# EAGLE design bicyclelab-manager-v3 (EAGLE 6.2)
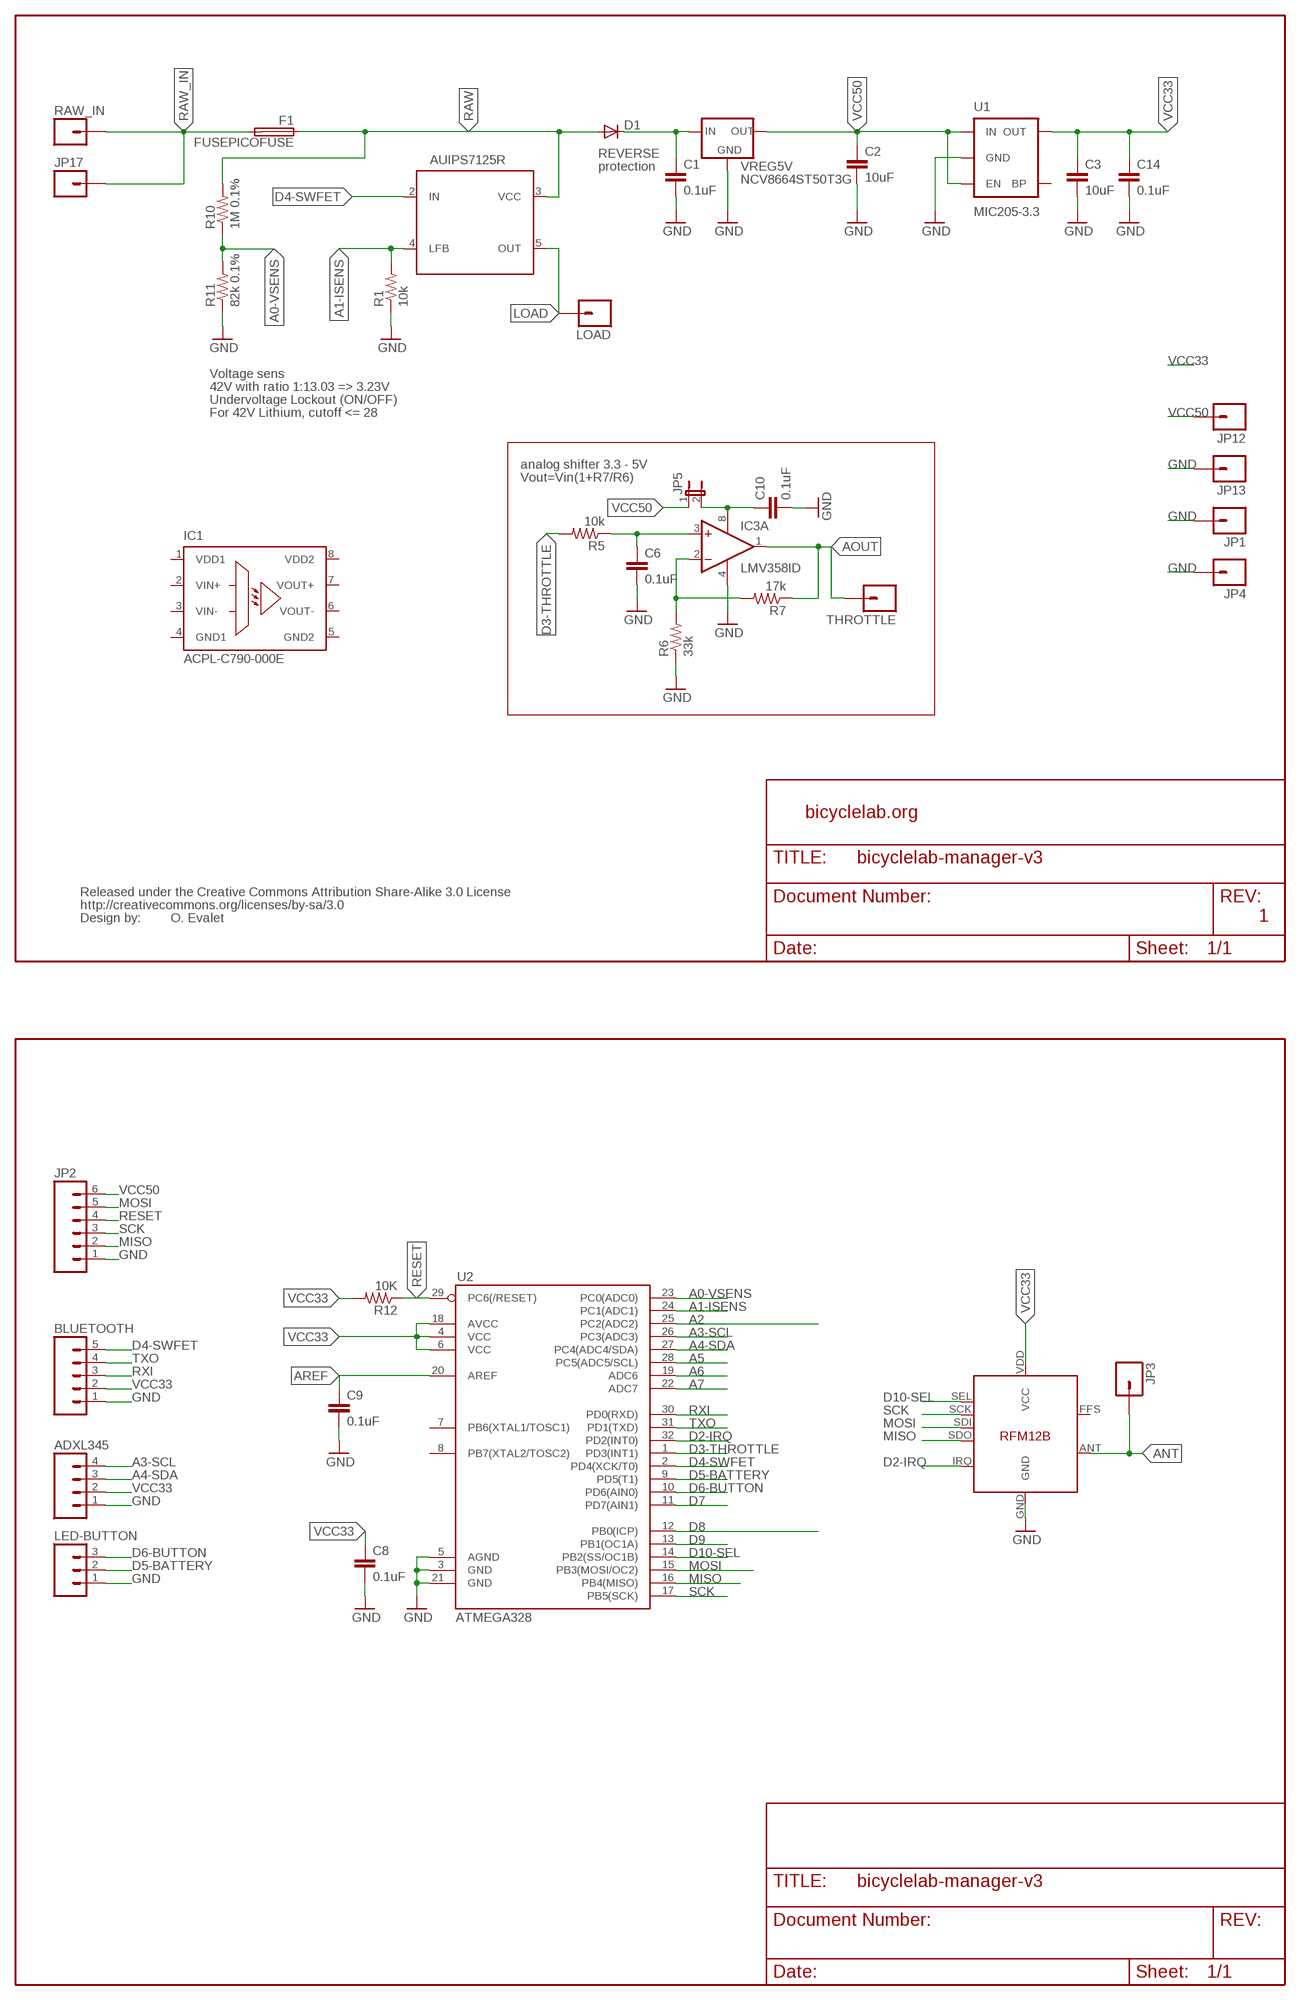
[diagram p0: schematic, sheet 1]

## Parts
ADXL345  M04PTH  [1X04]
BLUETOOTH  M05PTH  [1X05]
C1  0.1uF  CAP0805  [0805]
C2  10uF  CAP0805  [0805]
C3  10uF  CAP0805  [0805]
C6  0.1uF  CAP0805  [0805]
C8  0.1uF  CAP0603-CAP  [0603-CAP]
C9  0.1uF  CAP0603-CAP  [0603-CAP]
C10  0.1uF  CAP0805  [0805]
C14  0.1uF  CAP0603-CAP  [0603-CAP]
D1  DIODESOD  [SOD-323]
F1  FUSEPICOFUSE  [PICOFUSE]
IC1  ACPL-C790-000E  ACPL-790A  [DIP8]
IC3  LMV358ID  MCP602SN  [SO08]
JP1  M01PTH_2MM  [1X01_2MM]
JP2  M06EM406  [EM406]
JP3  M01SMD-4.5X1.5  [PAD-1.5X4.5]
JP4  M01PTH_2MM  [1X01_2MM]
JP5  JUMPER-2PTH_LOCK  [1X02_LOCK]
JP12  M01PTH  [1X01]
JP13  M01PTH  [1X01]
JP17  M01PTH_2MM  [1X01_2MM]
LED-BUTTON  M03PTH  [1X03]
LOAD  M01PTH_2MM  [1X01_2MM]
R1  10k  RESISTOR  [0805]
R5  10k  RESISTOR  [0805]
R6  33k  RESISTOR  [0805]
R7  17k  RESISTOR  [0805]
R10  1M 0.1%  RESISTOR  [0805]
R11  82k 0.1%  RESISTOR  [0805]
R12  10K  RESISTOR0603-RES  [0603-RES]
RAW_IN  M01PTH_2MM  [1X01_2MM]
THROTTLE  M01PTH  [1X01]
U1  MIC205-3.3  V_REG_LDOSMD  [SOT23-5]
U2  ATMEGA328  ATMEGA168  [TQFP32-08]
U$1  RFM12B  [RFM12B]
U$5  CREATIVE_COMMONS  [CREATIVE_COMMONS]
U$8  AUIPS7125R  [DPAK-5]
VREG5V  NCV8664ST50T3G  V_REG_MIC2920  [SOT223]

## Nets
A0-VSENS: R10.1 R11.2 U2.23(PC0(ADC0))
A1-ISENS: R1.2 U2.24(PC1(ADC1)) U$8.4(LFB)
A2: U2.25(PC2(ADC2))
A3-SCL: ADXL345.4 U2.26(PC3(ADC3))
A4-SDA: ADXL345.3 U2.27(PC4(ADC4/SDA))
A5: U2.28(PC5(ADC5/SCL))
A6: U2.19(ADC6)
A7: U2.22(ADC7)
ANT: JP3.P$1 U$1.ANT
AOUT: IC3.1(A:OUT) R7.1 THROTTLE.1
AREF: C9.1 U2.20(AREF)
D2-IRQ: U2.32(PD2(INT0)) U$1.IRQ
D3-THROTTLE: R5.2 U2.1(PD3(INT1))
D4-SWFET: BLUETOOTH.5 U2.2(PD4(XCK/T0)) U$8.2(IN)
D5-BATTERY: LED-BUTTON.2 U2.9(PD5(T1))
D6-BUTTON: LED-BUTTON.3 U2.10(PD6(AIN0))
D7: U2.11(PD7(AIN1))
D8: U2.12(PB0(ICP))
D9: U2.13(PB1(OC1A))
D10-SEL: U2.14(PB2(SS/OC1B)) U$1.SEL
GND: ADXL345.1 BLUETOOTH.1 C1.2 C2.2 C3.2 C6.2 C8.2 C9.2 C10.2 C14.2 IC3.4(P:V-) JP1.1 JP2.1 JP4.1 JP13.1 LED-BUTTON.1 R1.1 R6.1 R11.1 U1.2(GND) U2.3(GND) U2.5(AGND) U2.21(GND) U$1.GND VREG5V.2(GND)
LOAD: LOAD.1 U$8.5(OUT)
MISO: JP2.2 U2.16(PB4(MISO)) U$1.SDO
MOSI: JP2.5 U2.15(PB3(MOSI/OC2)) U$1.SDI
N$1: C1.1 D1.1(C) VREG5V.1(IN)
N$6: IC3.2(A:-IN) R6.2 R7.2
N$8: C6.1 IC3.3(A:+IN) R5.1
RAW: D1.2(A) F1.1 R10.2 U$8.3(VCC)
RAW_IN: F1.2 JP17.1 RAW_IN.1
RESET: JP2.4 R12.1 U2.29(PC6(/RESET))
RXI: BLUETOOTH.3 U2.30(PD0(RXD))
SCK: JP2.3 U2.17(PB5(SCK)) U$1.SCK
TXO: BLUETOOTH.4 U2.31(PD1(TXD))
VCC33: ADXL345.2 BLUETOOTH.2 C3.1 C8.1 C14.1 R12.2 U1.5(OUT) U2.4(VCC) U2.6(VCC) U2.18(AVCC) U$1.VDD(VCC)
VCC50: C2.1 JP2.6 JP5.1 JP12.1 U1.1(IN) U1.3(EN) VREG5V.3(OUT)
VCC50_: C10.1 IC3.8(P:V+) JP5.2
Unconnected: IC3.5(B:+IN) IC3.6(B:-IN) IC3.7(B:OUT) U1.4(BP) U2.7(PB6(XTAL1/TOSC1)) U2.8(PB7(XTAL2/TOSC2)) U$1.FFS U$8.1(NC)

## Notes on the sheet
- REVERSE
- protection
- Voltage sens
- 42V with ratio 1:13.03 => 3.23V
- Undervoltage Lockout (ON/OFF)
- For 42V Lithium, cutoff <= 28
- analog shifter 3.3 - 5V
- Vout=Vin(1+R7/R6)
- bicyclelab.org
- O. Evalet | 1

## Power pins joined to a net without a drawn wire
GND1: IC1.4(GND1)
GND2: IC1.5(GND2)
VDD1: IC1.1(VDD1)
VDD2: IC1.8(VDD2)
VIN+: IC1.2(VIN+)
VIN-: IC1.3(VIN-)
VOUT+: IC1.7(VOUT+)
VOUT-: IC1.6(VOUT-)

## Library data of the parts
ADXL345 = 0-SparkFun:M04: Header 4 Standard 4-pin 0.1" header. Use with straight break away headers (SKU : PRT-00116), right angle break away headers (PRT-00553), swiss pins (PRT-00743), machine pins (PRT-00117), and female headers (PRT-00115). Molex polarized connector foot print use with SKU : PRT-08231 with associated crimp pins and housings. 1MM SMD Version SKU: PRT-10208
BLUETOOTH = 0-SparkFun:M05: Header 5 Standard 5-pin 0.1" header. Use with straight break away headers (SKU : PRT-00116), right angle break away headers (PRT-00553), swiss pins (PRT-00743), machine pins (PRT-00117), and female headers (PRT-00115). Molex polarized connector foot print use with SKU : PRT-08230 with associated crimp pins and housings.
C1-C3 C6 C8-C10 C14 = SparkFun:CAP: Capacitor Standard 0603 ceramic capacitor, and 0.1" leaded capacitor.
D1 = 0-SparkFun:DIODE: Diode These are standard reverse protection diodes and small signal diodes. SMA package can handle up to about 1A. SOD-323 can handle about 200mA. What the SOD-323 package when ordering, there are some mfgs out there that are 5-pin packages.
F1 = fuse:FUSE: Fuse; OC_FARNELL: unknown; OC_NEWARK: unknown
IC1 = avago:ACPL-790: Precision Isolation Amplifiers Source: Data sheet <http://www.avagotech.com/docs/AV02-2733EN>
IC3 = linear:MCP602: Single Op Amp 2.7V to 6.0V Single Supply CMOS Source: http://ww1.microchip.com/downloads/en/DeviceDoc/21314g.pdf
JP1 JP4 JP12 JP13 JP17 LOAD RAW_IN THROTTLE = SparkFun:M01: Header 1 Standard 1-pin 0.1" header. Use with straight break away headers (SKU : PRT-00116), right angle break away headers (PRT-00553), swiss pins (PRT-00743), machine pins (PRT-00117), and female headers (PRT-00115).
JP2 = 0-SparkFun:M06: Header 6 Standard 6-pin 0.1" header. Use with straight break away headers (SKU : PRT-00116), right angle break away headers (PRT-00553), swiss pins (PRT-00743), machine pins (PRT-00117), and female headers (PRT-00115). Molex polarized connector foot print use with SKU : PRT-08094 with associated crimp pins and housings. NOTES ON THE VARIANTS LOCK and LOCK_LONGPADS... This footprint was designed to help hold the alignment of a through-hole component (i.e. 6-pin header) while soldering it into place. You may notice that each hole has been shifted either up or down by 0.005 of an inch from it's more standard position (which is a perfectly straight line). This slight alteration caused the pins (the squares in the middle) to touch the edges of the holes. Because they are alternating, it causes a "brace" to hold the component in place. 0.005 has proven to be the perfect amount of "off-center" position when using our standard breakaway headers. Although looks a little odd when you look at the bare footprint, once you have a header in there, the alteration is very hard to notice. Also, if you push a header all the way into place, it is covered up entirely on the bottom side. This idea of altering the position of holes to aid alignment will be further integrated into the Sparkfun Library for other footprints. It can help hold any component with 3 or more connection pins.
JP3 = 0-SparkFun:M01: Header 1 Standard 1-pin 0.1" header. Use with straight break away headers (SKU : PRT-00116), right angle break away headers (PRT-00553), swiss pins (PRT-00743), machine pins (PRT-00117), and female headers (PRT-00115).
JP5 = 0-SparkFun:JUMPER-2: Jumper Basic 0.1" spaced jumper. Use with breakaway headers.
LED-BUTTON = 0-SparkFun:M03: Header 3 Standard 3-pin 0.1" header. Use with straight break away headers (SKU : PRT-00116), right angle break away headers (PRT-00553), swiss pins (PRT-00743), machine pins (PRT-00117), and female headers (PRT-00115). Molex polarized connector foot print use with SKU : PRT-08232 with associated crimp pins and housings.
R1 R5-R7 R10-R12 = SparkFun:RESISTOR: Resistor Basic schematic elements and footprints for 0603, 1206, and PTH 1/10th watt (small) resistors.
U1 = SparkFun:V_REG_LDO: Voltage Regulator LDO Standard 150mA LDO voltage regulator in SOT-23 layout. Micrel part MIC5205. BP (by-pass) pin is used to lower output noise with 470pF cap.
U2 = SparkFun:ATMEGA168
U$1 = JeeParts:RFM12B
U$5 = SparkFun:CREATIVE_COMMONS
U$8 = bicyclelab:AUIPS7125R
VREG5V = 0-SparkFun:V_REG_MIC2920: MIC2920A (http://www.micrel.com/_PDF/mic2920.pdf) - 400mA output LDO Regulator

## Net classes
0 default: width 0.203 mm
1 power: width 0.508 mm

## Board
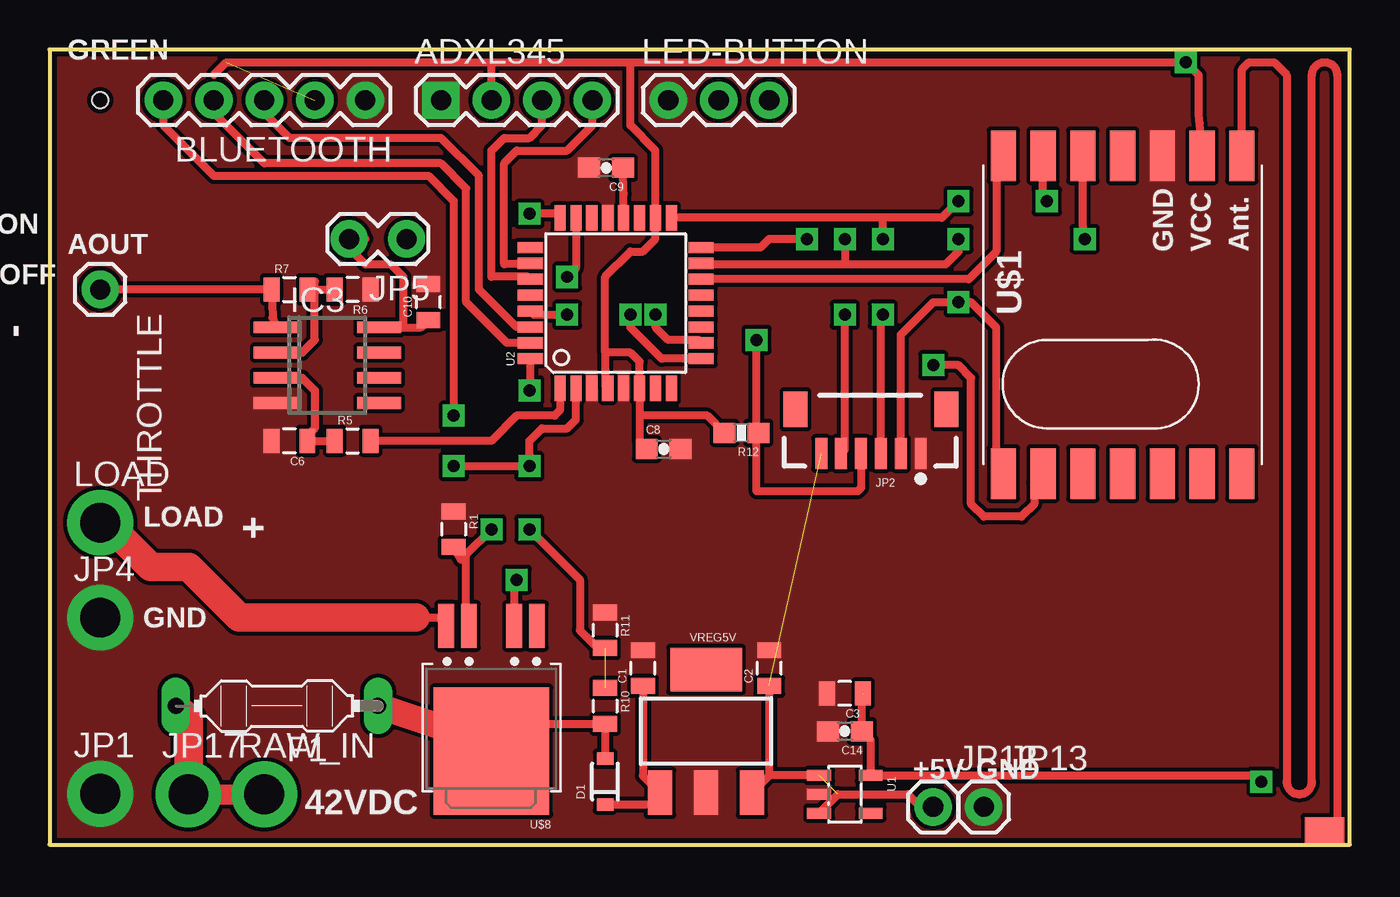
[diagram p1: board, top side]
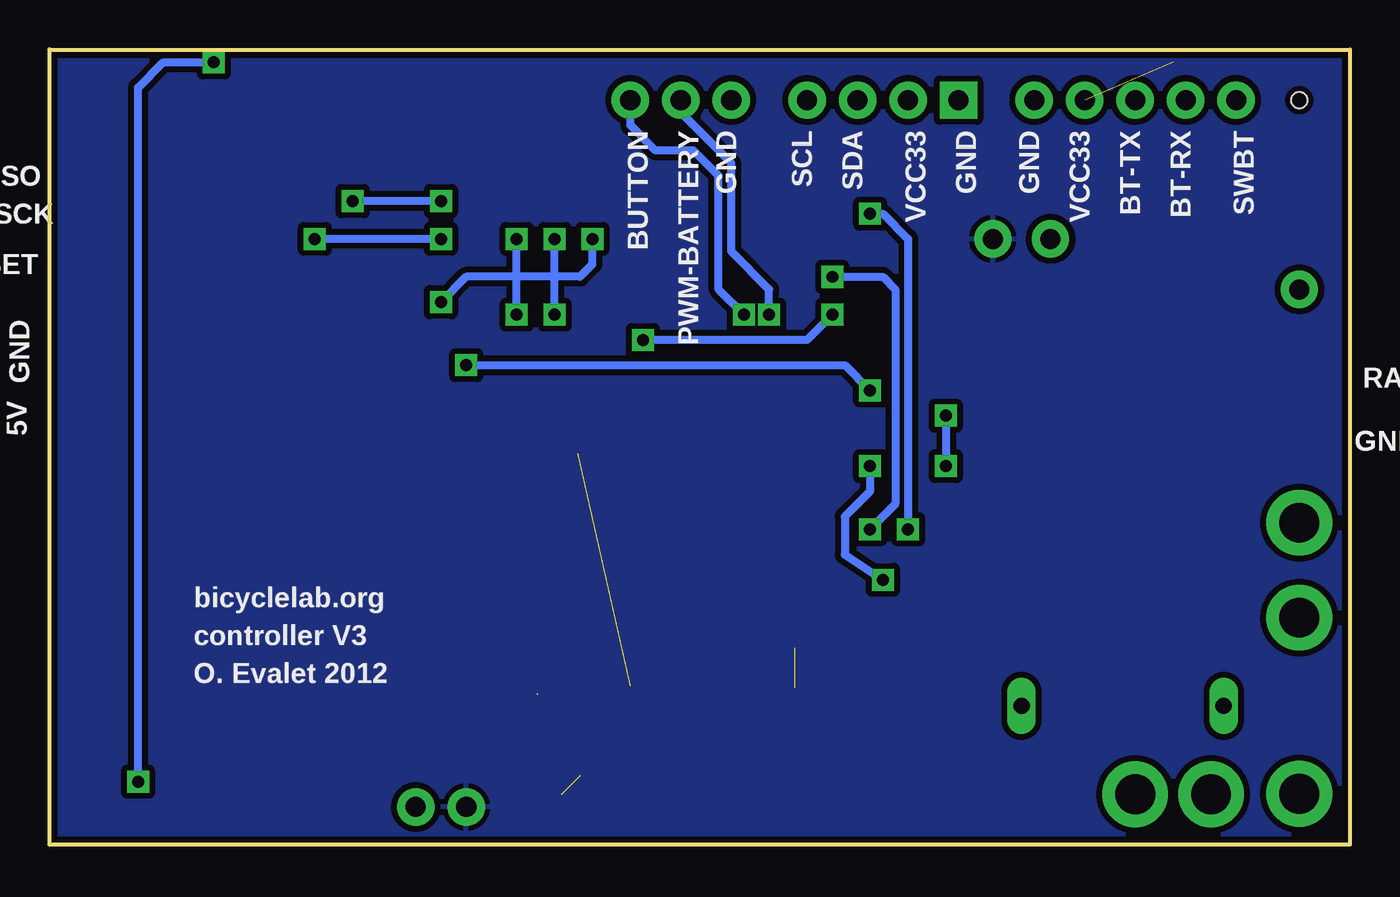
[diagram p2: board, bottom side, seen from below]

Size 65.41 x 40.01 mm. Coordinates in mm from the lower left corner, seen from the top.
Outline: 0,0 65.41,0 65.41,40.01 0,40.01 0,0
Copper layers (1*16): Top 0.035mm / dielectric 1.5mm / Bottom 0.035mm
Design rules: minimum track width 8mil, minimum drill 20mil, track to track 8mil, track to pad 8mil, pad to pad 8mil, via to via 8mil, smd to smd 8mil, copper to edge 10mil, drill to drill 8mil, minimum pad ring 12mil, minimum via ring 10mil, stop-mask expansion 4mil, vias tented up to drill 25mil, thermal gap 10mil
Holes 0.8 mm at 2.54,37.47

### Footprints (pad centres in the part's own frame; a part is rotated, then mirrored left to right if it is on the bottom)
1X04 = drill 1.016 pad 1.88 square: 1 0,0 | drill 1.016 pad 1.88: 2 2.54,0; 3 5.08,0; 4 7.62,0
1X05 = drill 1.016 pad 1.88: 1 0,0; 2 2.54,0; 3 5.08,0; 4 7.62,0; 5 10.16,0
0805 = smd 0.8 x 1.2: 1 -0.9,0; 2 0.9,0
0603-CAP = smd 1.1 x 1: 1 -0.85,0; 2 0.85,0
SOD-323 = smd 0.63 x 0.83: 1 -1.15,0; 2 1.15,0
PICOFUSE = drill 0.813 long: 1 -5.08,0; 2 5.08,0
DIP8 = smd 1.16 x 2: 1 -3.81,-4.45; 4 3.81,-4.45; 5 3.81,4.45; 8 -3.81,4.45 | smd 1.27 x 2: 2 -1.27,-4.45; 3 1.27,-4.45; 6 1.27,4.45; 7 -1.27,4.45
SO08 = smd 0.6 x 2.2: 1 -1.905,-2.6; 2 -0.635,-2.6; 3 0.635,-2.6; 4 1.905,-2.6; 5 1.905,2.6; 6 0.635,2.6; 7 -0.635,2.6; 8 -1.905,2.6
1X01_2MM = drill 2 pad 3.302: 1 0,0
EM406 = smd 0.6 x 1.55: 1 0,0; 2 1,0; 3 2,0; 4 3,0; 5 4,0; 6 5,0 | smd 1.2 x 1.8: P$1 -1.3,-2.225; P$2 6.3,-2.225
PAD-1.5X4.5 = smd 1.5 x 2: P$1 0,0
1X02_LOCK = drill 1.016 pad 1.88: 1 -0.178,0; 2 2.718,0
1X01 = drill 1.016 pad 1.88: 1 0,0
1X03 = drill 1.016 pad 1.88: 1 0,0; 2 2.54,0; 3 5.08,0
0603-RES = smd 1.1 x 1: 1 -0.85,0; 2 0.85,0
SOT23-5 = smd 0.55 x 1.2: 1 -0.95,-1.3; 2 0,-1.3; 3 0.95,-1.3; 4 0.95,1.3; 5 -0.95,1.3
TQFP32-08 = smd 1.27 x 0.559: 1 -4.293,2.8; 2 -4.293,2; 3 -4.293,1.2; 4 -4.293,0.4; 5 -4.293,-0.4; 6 -4.293,-1.2; 7 -4.293,-2; 8 -4.293,-2.8; 17 4.293,-2.8; 18 4.293,-2; 19 4.293,-1.2; 20 4.293,-0.4; 21 4.293,0.4; 22 4.293,1.2; 23 4.293,2; 24 4.293,2.8 | smd 0.559 x 1.27: 9 -2.8,-4.293; 10 -2,-4.293; 11 -1.2,-4.293; 12 -0.4,-4.293; 13 0.4,-4.293; 14 1.2,-4.293; 15 2,-4.293; 16 2.8,-4.293; 25 2.8,4.293; 26 2,4.293; 27 1.2,4.293; 28 0.4,4.293; 29 -0.4,4.293; 30 -1.2,4.293; 31 -2,4.293; 32 -2.8,4.293
RFM12B = smd 2.54 x 1.27: ANT 8,-6; FFS -8,2; GND 8,-2; IRQ -8,4; P$8 -8,0; P$9 -8,-2; P$10 -8,-4; P$12 -8,-6; P$16 8,0; SCK 8,4; SDI 8,2; SDO -8,6; SEL 8,6; VDD 8,-4
DPAK-5 = smd 0.8 x 2.2: 1 -2.28,-5.3; 2 -1.14,-5.3; 4 1.14,-5.3; 5 2.28,-5.3 | smd 5.8 x 6.4: 3 0,1
SOT223 = smd 1.219 x 2.235: 1 -2.311,-3.099; 2 0,-3.099; 3 2.311,-3.099 | smd 3.6 x 2.2: 4 0,3.099

### Placement (x,y rotation side)
ADXL345  19.68,37.47 0 top
BLUETOOTH  15.88,37.47 180 top
C1  29.84,8.89 90 top
C2  36.2,8.89 90 top
C3  40.01,7.62 180 top
C6  12.06,20.32 180 top
C8  30.89,19.91 0 top
C9  27.99,34.06 180 top
C10  19.05,27.3 90 top
C14  40.01,5.71 180 top
D1  27.94,3.17 90 top
F1  11.43,6.99 180 top
IC1  -12.06,-17.14 0 top  (outside the outline)
IC3  13.97,24.13 270 top
JP1  2.54,2.57 0 top
JP2  43.81,19.68 180 top
JP3  64.14,0.64 270 top
JP4  2.54,11.43 0 top
JP5  17.78,30.48 180 top
JP12  44.45,1.91 0 top
JP13  46.99,1.91 0 top
JP17  6.99,2.54 0 top
LED-BUTTON  31.11,37.47 0 top
LOAD  2.54,16.21 0 top
R1  20.32,15.88 270 top
R5  15.24,20.32 0 top
R6  15.24,27.94 180 top
R7  12.06,27.94 0 top
R10  27.94,6.99 270 top
R11  27.94,10.79 270 top
R12  34.8,20.73 180 top
RAW_IN  10.79,2.54 0 top
THROTTLE  2.54,27.94 270 top
U1  40.01,2.54 270 top
U2  28.47,27.25 90 top
U$1  53.98,26.67 90 top
U$5  1.27,-10.16 0 top  (outside the outline)
U$8  22.23,5.71 180 top
VREG5V  33.02,5.71 0 top

### Tracks (layer width: path | path; a pad name or v marks a point on that pad's centre or on a via)
A0-VSENS  (via drill 0.6)  (1 unrouted)
  Top 0.406: U2.23 26.47,29.01 v26.04,28.57 | v24.13,15.88 26.67,13.34 26.67,10.79 27.57,9.89 R11.2
  Bottom 0.406: v26.04,28.57 23.5,28.57 22.86,27.94 22.86,17.14 v24.13,15.88
A1-ISENS  (via drill 0.6)
  Top 0.406: U2.24 25.47,31.75 v24.13,31.75 | v22.23,15.88 20.95,14.61 | 20.95,14.61 20.69,14.34 R1.2 | U$8.4 20.95,11.14 20.95,14.61
  Bottom 0.406: v24.13,31.75 23.5,31.75 22.23,30.48 v22.23,15.88
A3-SCL
  Top 0.406: U2.26 24.14,29.21 22.86,29.21 22.86,34.29 23.5,34.92 26.04,34.92 27.3,36.2 ADXL345.4
A4-SDA
  Top 0.406: U2.27 24.06,28.57 22.23,28.57 22.23,34.92 22.86,35.56 24.13,35.56 24.77,36.2 ADXL345.3
ANT
  Top 0.406: JP3.P$1 arc90 64.77,1.27 64.77,38.73 arc180 63.5,38.73 63.5,3.17 arc-90 62.87,2.54 arc-90 62.23,3.17 62.23,38.73 61.59,39.37 60.33,39.37 59.98,39.02 U$1.ANT
AOUT
  Top 0.406: IC3.1 11.21,26.52 R7.1 THROTTLE.1
AREF
  Top 0.406: C9.1 28.87,32.76 U2.20
D2-IRQ  (via drill 0.6)
  Top 0.406: U$1.IRQ 49.53,18.23 49.53,17.14 48.9,16.51 46.99,16.51 46.35,17.14 46.35,23.5 45.72,24.13 v44.45,24.13 | v24.13,22.86 24.18,22.91 U2.32
  Bottom 0.406: v44.45,24.13 25.4,24.13 v24.13,22.86
D3-THROTTLE
  Top 0.406: U2.1 25.67,21.86 25.4,21.59 23.5,21.59 22.23,20.32 R5.2
D4-SWFET  (via drill 0.6)
  Top 0.406: 23.5,11.14 U$8.2 23.36,13.21 v23.5,13.34 | U2.2 26.47,21.39 26.04,20.95 24.77,20.95 24.13,20.32 v24.13,19.05 v20.32,19.05 | BLUETOOTH.5 5.71,36.2 8.26,33.66 19.05,33.66 20.32,32.38 v20.32,21.59
  Bottom 0.406: v20.32,21.59 v20.32,19.05 | v24.13,19.05 24.13,17.78 25.4,16.51 25.4,14.61 v23.5,13.34
D5-BATTERY  (via drill 0.6)
  Top 0.406: U2.9 30.79,24.45 29.21,26.04 v29.21,26.67
  Bottom 0.406: v29.21,26.67 29.21,27.94 31.11,29.84 31.11,34.29 33.66,36.83 LED-BUTTON.2
D6-BUTTON  (via drill 0.6)
  Top 0.406: U2.10 32.62,25.4 31.11,25.4 30.48,26.04 v30.48,26.67
  Bottom 0.406: v30.48,26.67 31.75,27.94 31.75,33.66 33.02,34.92 34.92,34.92 36.2,36.2 LED-BUTTON.3
D10-SEL
  Top 0.406: U$1.SEL 47.62,34.32 47.62,29.84 46.23,28.45 U2.14
GND
  pour Top (isolate 0.203, rank 2, no thermals): 0,0 0,40.01 65.41,40.01 65.41,0
LOAD
  Top 0.406: 18.41,11.43 19.53,11.43 U$8.5
  Top 1.422: LOAD.1 2.85,16.2 5.08,13.97 6.99,13.97 9.53,11.43 18.41,11.43
MISO  (via drill 0.6)
  Top 0.406: U$1.SDO 47.62,19.02 47.62,26.04 46.35,27.3 v45.72,27.3 44.45,27.3 42.81,25.67 JP2.2 | v38.1,30.48 36.2,30.48 35.77,30.05 U2.16
  Bottom 0.406: v38.1,30.48 38.1,29.21 38.73,28.57 44.45,28.57 v45.72,27.3
MOSI  (via drill 0.6)
  Top 0.406: U2.15 32.81,29.21 40.01,29.21 | 40.01,29.21 45.09,29.21 45.72,29.84 v45.72,30.48 | v52.07,30.48 51.98,31.21 U$1.SDI | JP2.5 40.01,19.88 v40.01,26.67 | v40.01,30.48 40.01,29.21
  Bottom 0.406: v45.72,30.48 v52.07,30.48 | v40.01,26.67 v40.01,30.48
N$1
  Top 0.406: C1.1 29.84,3.48 VREG5V.1 30.48,2.39 30.48,1.91 30.36,2.02 D1.1
N$6
  Top 0.406: IC3.2 12.7,24.77 13.34,25.4 13.34,28.36 R7.2 R6.2
N$8
  Top 0.406: IC3.3 12.7,23.5 13.34,22.86 13.34,20.95 12.96,20.59 C6.1 R5.1
RAW
  Top 0.406: U$8.3 23.59,6.08 R10.2 D1.2
  Top 1.27: F1.1 20.32,5.71 22.86,5.71 22.23,5.08 U$8.3
RAW_IN
  Top 1.016: JP17.1 RAW_IN.1
  Top 1.422: JP17.1 6.99,6.35 F1.2
RESET  (via drill 0.6)
  Top 0.406: U2.29 24.36,26.67 v26.04,26.67 | v35.56,25.4 35.56,20.81 R12.1 35.56,20.64 35.56,17.78 40.64,17.78 40.81,17.95 JP2.4
  Bottom 0.406: v26.04,26.67 27.3,25.4 v35.56,25.4
RXI
  Top 0.406: U2.30 23.48,26.05 21.59,27.94 21.59,33.66 19.68,35.56 12.06,35.56 10.79,36.83 BLUETOOTH.3
SCK  (via drill 0.6)
  Top 0.406: 50.16,34.86 U$1.SCK 49.98,32.58 v50.16,32.38 | v45.72,32.38 44.88,31.55 41.91,31.55 | 41.91,31.55 U2.17 | JP2.3 41.81,26.57 v41.91,26.67 | v41.91,30.48 41.91,31.55
  Bottom 0.406: v45.72,32.38 v50.16,32.38 | v41.91,26.67 v41.91,30.48
TXO
  Top 0.406: U2.31 23.01,25.25 20.95,27.3 20.95,33.02 19.68,34.29 10.79,34.29 8.26,36.83 BLUETOOTH.4
VCC33  (via drill 0.6)  (2 unrouted)
  Top 0.406: 40.85,7.57 C14.1 41.3,5.26 U1.5 60.65,3.49 v60.96,3.17 | 8.26,38.73 8.89,39.37 22.23,39.37 | 22.23,39.37 29.21,39.37 | 29.21,39.37 v57.15,39.37 57.78,38.73 57.78,36.77 U$1.VDD | ADXL345.2 22.23,39.37 | 29.21,39.37 29.21,36.2 30.47,34.93 U2.18 30.47,30.47 29.84,29.84 29.21,29.84 27.94,28.57 27.94,24.77 | 29.67,21.59 U2.6 29.67,24.3 29.21,24.77 27.94,24.77 | 29.67,21.59 29.67,20.36 C8.1 | 27.94,24.77 27.94,23.09 U2.4 | R12.2 33.08,21.59 29.67,21.59
  Bottom 0.406: v60.96,3.17 60.96,38.1 59.69,39.37 v57.15,39.37
VCC50  (2 unrouted)
  Top 0.406: U1.1 36.2,3.49 36.2,3.48 | 36.2,3.48 VREG5V.3 | C2.1 36.2,3.48 | U1.3 39.66,2.54 43.18,2.54 43.81,1.91 JP12.1
  pour Bottom (isolate 0.305): 0,40.01 65.41,40.01 65.41,0 0,0
VCC50_
  Top 0.406: IC3.8 17.78,26.04 | 17.78,26.04 18.68,26.04 C10.1 | JP5.2 15.88,30.48 15.24,29.84 15.88,29.21 17.14,29.21 17.78,28.57 17.78,26.04

### Text on the board
tPlace: GREEN | ON | AOUT | OFF | - | LOAD | + | GND | +5V | GND | 42VDC
bPlace: SWBT | BT-RX | BT-TX | VCC33 | GND | GND | VCC33 | SDA | SCL | GND | PWM-BATTERY | BUTTON | MISO | SCK | RESET | GND | RAW | GND | 5V | bicyclelab.org | controller V3 | O. Evalet 2012